# Altium project WordClockV2.PrjPcb
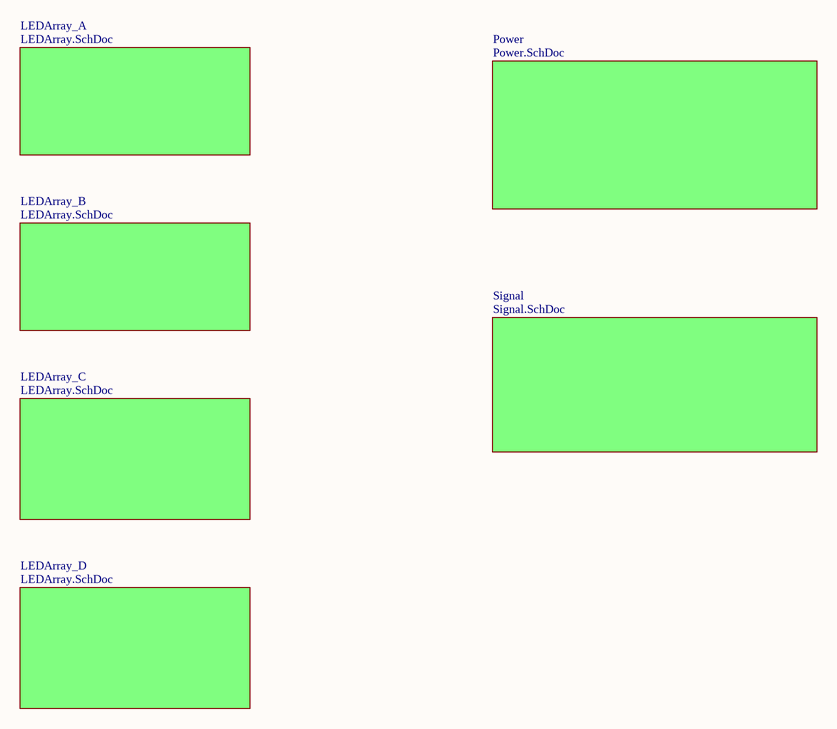
[diagram p0: Master.SchDoc]
4 sheets, 4 parts. Net scope: global (net labels, ports and power ports of the same name join across sheets).
Sheets:
  Master.SchDoc
    LEDArray_A = LEDArray.SchDoc
    LEDArray_B = LEDArray.SchDoc
    LEDArray_C = LEDArray.SchDoc
    LEDArray_D = LEDArray.SchDoc
    Power = Power.SchDoc
    Signal = Signal.SchDoc

## Sheet Master.SchDoc: Master
size A4; Revision: 01

### Sub-sheets
LEDArray_A = LEDArray.SchDoc: no entries
LEDArray_B = LEDArray.SchDoc: no entries
LEDArray_C = LEDArray.SchDoc: no entries
LEDArray_D = LEDArray.SchDoc: no entries
Power = Power.SchDoc: no entries
Signal = Signal.SchDoc: no entries

### Notes on the sheet
- Title
- Size:
- Date:
- A4
- Number:
- Time:
- Revision:
- Sheet
- of
- File:

## Sheet LEDArray.SchDoc
size A4
Used 4 times, as channels LEDArray_A, LEDArray_B, LEDArray_C, LEDArray_D. Parts and nets are listed once, with the designators drawn on the sheet.
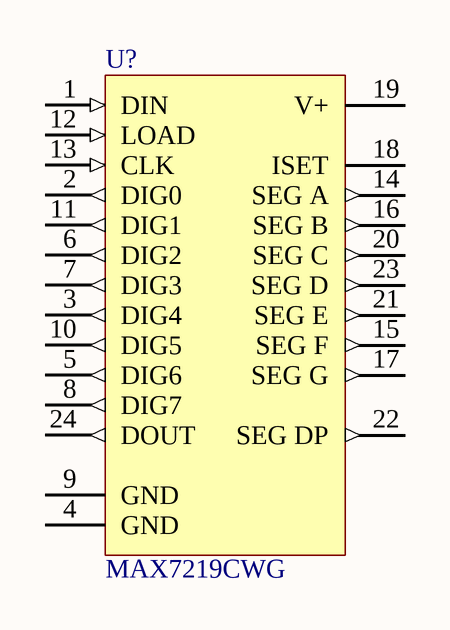
[diagram p1: LEDArray.SchDoc]

### Parts
U?  MAX7219CWG  [WSO24_N]

### Nets

Not connected (* = marked no-connect by the designer): U? 1(DIN) 2(DIG0) 3(DIG4) 4(GND) 5(DIG6) 6(DIG2) 7(DIG3) 8(DIG7) 9(GND) 10(DIG5) 11(DIG1) 12(LOAD) 13(CLK) 14(SEG_A) 15(SEG_F) 16(SEG_B) 17(SEG_G) 18(ISET) 19(V+) 20(SEG_C) 21(SEG_E) 22(SEG_DP) 23(SEG_D) 24(DOUT)

### Channels
LEDArray_A: designators end in _LEDArray_A
LEDArray_B: designators end in _LEDArray_B
LEDArray_C: designators end in _LEDArray_C
LEDArray_D: designators end in _LEDArray_D

### Notes on the sheet
- Title
- Size:
- Date:
- A4
- Number:
- Time:
- Revision:
- Sheet
- of
- File:

### Library data of the parts
U? = MAX7219CWG: Serially Interfaced, 8-Digit LED Display Driver; Published: 16-Jan-2001; LatestRevisionDate: 13-Apr-2006; LatestRevisionNote: IPC-7351 Footprint Added.; DatasheetVersion: Jul-1997; PackageReference: WSO24; Publisher: Altium Limited; PackageDescription: 24-Pin Small Outline Integrated Circuit 1.27 mm Pitch; ComponentLink1Description: Manufacturer Link; ComponentLink1URL: http://www.maxim-ic.com/; ComponentLink2Description: Datasheet; ComponentLink2URL: http://pdfserv.maxim-ic.com/en/ds/MAX7219-MAX7221.pdf

## Sheet Power.SchDoc: Power
size A4

## Sheet Signal.SchDoc: Signal
size A4; Organization: ParrottalkCreations

### Notes on the sheet
- Title
- Size:
- Date:
- A4
- Number:
- Time:
- Revision:
- Sheet
- of
- File: